# Altium schematic sheet Sheet1.SchDoc
size A4; SheetNumber: 1; SheetTotal: 1
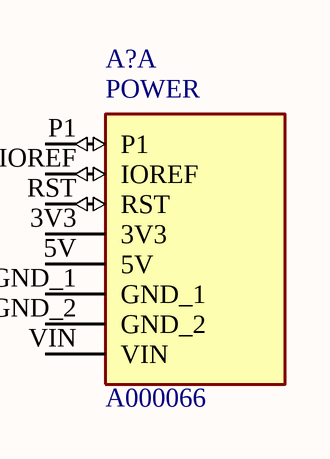
[diagram p0: Sheet1.SchDoc]

## Parts
A?  A000066  [ARDUINO_A000066]  (part A of 4)

## Nets

Not connected (* = marked no-connect by the designer): A? 3V3 5V GND_1 GND_2 IOREF P1 RST VIN

## Notes on the sheet
- (in symbol A000066, part A) POWER

## Library data of the parts
A? = A000066: Microcontroller board based on the ATmega328P.; pin to pad: A4(SDA)>A4(SDA; MF: Arduino; MP: Arduino Uno Rev3; Value: *; SnapEDA_Link: https://www.snapeda.com/parts/Arduino%20Uno%20Rev3/Arduino/view-part/?ref=snap; Availability: Not in stock; Price: None; Package: Non-Standard Arduino; Check_prices: https://www.snapeda.com/parts/Arduino%20Uno%20Rev3/Arduino/view-part/?ref=eda